# Altium schematic sheet mtk_schematic.SchDoc
size A4
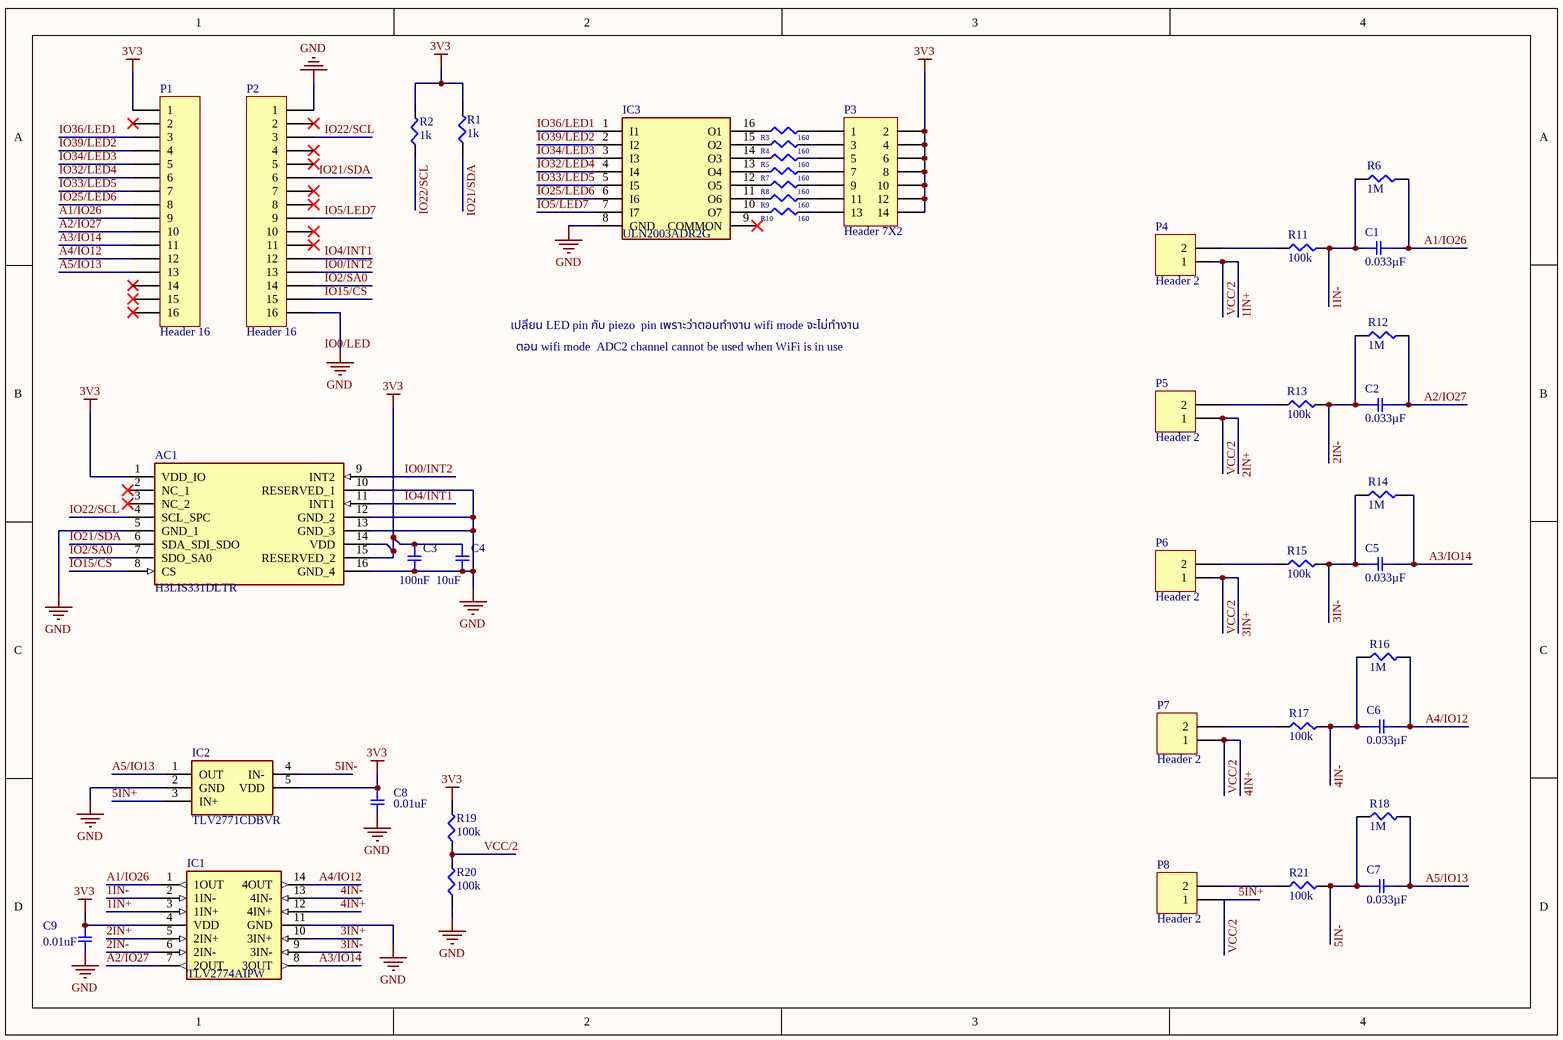
[diagram p0: mtk_schematic.SchDoc]

## Parts
AC1  H3LIS331DLTR  [PQFN50P300X300X100-16N]
C1  0.033µF  [SMD-1206C]
C2  0.033µF  [SMD-1206C]
C3  100nF  [SMD-1206C]
C4  10uF  [SMD-1206C]
C5  0.033µF  [SMD-1206C]
C6  0.033µF  [SMD-1206C]
C7  0.033µF  [SMD-1206C]
C8  0.01uF  [SMD-1206C]
C9  0.01uF  [SMD-1206C]
IC1  TLV2774AIPW  [SOP65P640X120-14N]
IC2  TLV2771CDBVR  [SOT95P280X145-5N]
IC3  ULN2003ADR2G  [SOIC127P600X175-16N]
P1  Header 16  [HDR1X16]
P2  Header 16  [HDR1X16]
P3  Header 7X2  [HDR2X7]
P4  Header 2  [HDR1X2]
P5  Header 2  [HDR1X2]
P6  Header 2  [HDR1X2]
P7  Header 2  [HDR1X2]
P8  Header 2  [HDR1X2]
R1  1k  [SMD-1206-RES]
R2  1k  [SMD-1206-RES]
R3  160  [SMD-1206-RES]
R4  160  [SMD-1206-RES]
R5  160  [SMD-1206-RES]
R6  1M  [SMD-1206-RES]
R7  160  [SMD-1206-RES]
R8  160  [SMD-1206-RES]
R9  160  [SMD-1206-RES]
R10  160  [SMD-1206-RES]
R11  100k  [SMD-1206-RES]
R12  1M  [SMD-1206-RES]
R13  100k  [SMD-1206-RES]
R14  1M  [SMD-1206-RES]
R15  100k  [SMD-1206-RES]
R16  1M  [SMD-1206-RES]
R17  100k  [SMD-1206-RES]
R18  1M  [SMD-1206-RES]
R19  100k  [SMD-1206-RES]
R20  100k  [SMD-1206-RES]
R21  100k  [SMD-1206-RES]

## Nets
3V3: AC1.1(VDD_IO) AC1.14(VDD) AC1.15(RESERVED_2) C3.1 C4.1 C8.1 C9.1 IC1.4(VDD) IC2.5(VDD) P1.1 P3.2 P3.4 P3.6 P3.8 P3.10 P3.12 P3.14 R1.2 R2.2 R19.2
GND: AC1.5(GND_1) AC1.10(RESERVED_1) AC1.12(GND_2) AC1.13(GND_3) AC1.16(GND_4) C3.2 C4.2 C8.2 C9.2 IC1.11(GND) IC2.2(GND) IC3.8(GND) P2.1 P2.16 R20.1
1IN+: IC1.3(1IN+) IC1.5(2IN+) IC1.10(3IN+) IC1.12(4IN+) IC2.3(IN+) P4.1 P5.1 P6.1 P7.1 P8.1 R19.1 R20.2  [also labelled 2IN+, 3IN+, 4IN+, 5IN+, VCC/2]
1IN-: C1.2 IC1.2(1IN-) R6.1 R11.2
2IN-: C2.1 IC1.6(2IN-) R12.1 R13.2
3IN-: C5.1 IC1.9(3IN-) R14.1 R15.2
4IN-: C6.1 IC1.13(4IN-) R16.1 R17.2
5IN-: C7.1 IC2.4(IN-) R18.1 R21.2
A1/IO26: C1.1 IC1.1(1OUT) P1.9 R6.2
A2/IO27: C2.2 IC1.7(2OUT) P1.10 R12.2
A3/IO14: C5.2 IC1.8(3OUT) P1.11 R14.2
A4/IO12: C6.2 IC1.14(4OUT) P1.12 R16.2
A5/IO13: C7.2 IC2.1(OUT) P1.13 R18.2
IO0/INT2: AC1.9(INT2) P2.13
IO2/SA0: AC1.7(SDO_SA0) P2.14
IO4/INT1: AC1.11(INT1) P2.12
IO5/LED7: IC3.7(I7) P2.9
IO15/CS: AC1.8(CS) P2.15
IO21/SDA: AC1.6(SDA_SDI_SDO) P2.6 R1.1
IO22/SCL: AC1.4(SCL_SPC) P2.3 R2.1
IO25/LED6: IC3.6(I6) P1.8
IO32/LED4: IC3.4(I4) P1.6
IO33/LED5: IC3.5(I5) P1.7
IO34/LED3: IC3.3(I3) P1.5
IO36/LED1: IC3.1(I1) P1.3
IO39/LED2: IC3.2(I2) P1.4
NetIC3_10: IC3.10(O7) R10.1
NetIC3_11: IC3.11(O6) R9.1
NetIC3_12: IC3.12(O5) R8.1
NetIC3_13: IC3.13(O4) R7.1
NetIC3_14: IC3.14(O3) R5.1
NetIC3_15: IC3.15(O2) R4.1
NetIC3_16: IC3.16(O1) R3.1
NetP3_1: P3.1 R3.2
NetP3_3: P3.3 R4.2
NetP3_5: P3.5 R5.2
NetP3_7: P3.7 R7.2
NetP3_9: P3.9 R8.2
NetP3_11: P3.11 R9.2
NetP3_13: P3.13 R10.2
NetP4_2: P4.2 R11.1
NetP5_2: P5.2 R13.1
NetP6_2: P6.2 R15.1
NetP7_2: P7.2 R17.1
NetP8_2: P8.2 R21.1

Not connected (* = marked no-connect by the designer): AC1 2(NC_1)* 3(NC_2)*; IC3 9(COMMON)*; P1 2* 14* 15* 16*; P2 2* 4* 5* 7* 8* 10* 11*

## Notes on the sheet
- เปลี่ยน LED pin กับ piezo  pin เพราะว่าตอนทำงาน wifi mode จะไม่ทำงาน
- ตอน wifi mode  ADC2 channel cannot be used when WiFi is in use
- Labels drawn without touching a wire or pin: IO0/LED

## Library data of the parts
AC1 = H3LIS331DLTR: Accelerometer; Manufacturer_Name: STMicroelectronics; Datasheet Link: http://www.st.com/st-web-ui/static/active/en/resource/technical/document/datasheet/DM00053090.pdf; Height: 1mm; Manufacturer_Part_Number: H3LIS331DLTR; Mouser Part Number: 511-H3LIS331DLTR; Mouser Price/Stock: https://www.mouser.com/Search/Refine.aspx?Keyword=511-H3LIS331DLTR; RS Part Number: 1106549P; RS Price/Stock: http://uk.rs-online.com/web/p/products/1106549P
C1 C2 C5-C7 = GC331AD72E333KX01D: CAP CER 0.033UF 250V X7T 1206; Manufacturer: Murata Electronics North America; Factory Stock: 0; Unit Price (USD): 0.33; Minimum Quantity: 1; Tolerance: ±10%; Datasheets: http://search.murata.co.jp/Ceramy/image/img/A01X/G101/ENG/GC331AD72E333KX01-01.pdf; Image: //media.digikey.com/Renders/Murata%20Renders/1206(GC3)320x160.jpg; Digi-Key Part Number: 490-13989-1-ND; Part Number: GC331AD72E333KX01D; Quantity Available: 3999; @ qty: 0; Packaging: Cut Tape (CT); Series: GC3; Part Status: Active; Value: 0.033µF; Voltage: 250V; Temperature Coefficient: X7T; Operating Temperature: -55°C ~ 125°C; Features: -; Ratings: AEC-Q200; Applications: Automotive; Mounting Type: Surface Mount, MLCC; Package / Case: 1206 (3216 Metric); Size / Dimension: 0.126" L x 0.063" W (3.20mm x 1.60mm); Height - Seated (Max): -; Thickness (Max): 0.039" (1.00mm); Lead Spacing: -; Lead Style: -
C3 C4 C8 C9 = LLM315R71C104MA11L: CAP CER 0.1UF 16V X7R 1206; Manufacturer: Murata Electronics North America; Factory Stock: 0; Unit Price (USD): 0.9; Minimum Quantity: 1; Value: 0.10µF; Tolerance: ±20%; Datasheets: http://www.murata.com/~/media/webrenewal/support/library/catalog/products/capacitor/mlcc/c02e.pdf; Image: //media.digikey.com/Renders/Murata%20Renders/1206(LLM315).jpg; Digi-Key Part Number: 490-4495-1-ND; Part Number: LLM315R71C104MA11L; Quantity Available: 2915; @ qty: 0; Packaging: Cut Tape (CT); Series: LLM; Part Status: Active; Voltage: 16V; Temperature Coefficient: X7R; Operating Temperature: -55°C ~ 125°C; Features: Low ESL (Multi-Terminal); Ratings: -; Applications: Bypass, Decoupling; Mounting Type: Surface Mount, MLCC; Package / Case: 1206 (3216 Metric); Size / Dimension: 0.126" L x 0.063" W (3.20mm x 1.60mm); Height - Seated (Max): -; Thickness (Max): 0.022" (0.55mm); Lead Spacing: -; Lead Style: -
IC1 = TLV2774AIPW: Integrated Circuit; Manufacturer_Name: Texas Instruments; Datasheet Link: http://www.ti.com/lit/ds/symlink/tlv2774a.pdf; Height: 1.2mm; Manufacturer_Part_Number: TLV2774AIPW; RS Part Number: 4625114; RS Price/Stock: https://uk.rs-online.com/web/p/products/4625114
IC2 = TLV2771CDBVR: Integrated Circuit; Manufacturer_Name: Texas Instruments; Datasheet Link: http://www.ti.com/lit/gpn/tlv2771; Manufacturer_Part_Number: TLV2771CDBVR; Mouser Part Number: 595-TLV2771CDBVR; Mouser Price/Stock: https://www.mouser.com/Search/Refine.aspx?Keyword=595-TLV2771CDBVR
IC3 = ULN2003ADR2G: Integrated Circuit; Manufacturer_Name: ON Semiconductor; Datasheet Link: http://www.onsemi.com/pub/Collateral/ULN2003A-D.PDF; Height: 1.75mm; Manufacturer_Part_Number: ULN2003ADR2G; Mouser Part Number: 863-ULN2003ADR2G; Mouser Price/Stock: https://www.mouser.com/Search/Refine.aspx?Keyword=863-ULN2003ADR2G; RS Part Number: 1868994; RS Price/Stock: http://uk.rs-online.com/web/p/products/1868994
P1 P2 = Header 16: Header, 16-Pin; LatestRevisionDate: 17-Jul-2002; LatestRevisionNote: Re-released for DXP Platform.; Publisher: Altium Limited
P3 = Header 7X2: Header, 7-Pin, Dual row; LatestRevisionDate: 17-Jul-2002; LatestRevisionNote: Re-released for DXP Platform.; Publisher: Altium Limited
P4-P8 = Header 2: Header, 2-Pin; LatestRevisionDate: 17-Jul-2002; LatestRevisionNote: Re-released for DXP Platform.; Publisher: Altium Limited
R1 R2 = ERJ-8ENF1001V: RES SMD 1K OHM 1% 1/4W 1206; Manufacturer: Panasonic Electronic Components; Factory Stock: 0; Unit Price (USD): 0.00933; @ qty: 1500; Minimum Quantity: 1; Power (Watts): 0.25W, 1/4W; Temperature Coefficient: ±100ppm/°C; Part Number: ERJ-8ENF1001V; Datasheets: http://industrial.panasonic.com/www-cgi/jvcr13pz.cgi?E+PZ+3+AOA0002+ERJ8ENF1001V+7+WW; Image: //media.digikey.com/Renders/Panasonic%20Renders/ERJ-1206%20Pkg.jpg; Digi-Key Part Number: P1.00KFCT-ND; Quantity Available: 607104; Packaging: Cut Tape (CT); Series: ERJ; Part Status: Active; Value: 1k; Tolerance: ±1%; Composition: Thick Film; Features: Automotive AEC-Q200; Operating Temperature: -55°C ~ 155°C; Package / Case: 1206 (3216 Metric); Supplier Device Package: 1206; Size / Dimension: 0.126" L x 0.063" W (3.20mm x 1.60mm); Height - Seated (Max): 0.028" (0.70mm); Number of Terminations: 2; Failure Rate: -
R3-R5 R7-R10 = ERJ-8ENF1600V: RES SMD 160 OHM 1% 1/4W 1206; Manufacturer: Panasonic Electronic Components; Factory Stock: 0; Unit Price (USD): 0.00933; @ qty: 1500; Minimum Quantity: 1; Power (Watts): 0.25W, 1/4W; Temperature Coefficient: ±100ppm/°C; Part Number: ERJ-8ENF1600V; Datasheets: http://industrial.panasonic.com/www-cgi/jvcr13pz.cgi?E+PZ+3+AOA0002+ERJ8ENF1600V+7+WW; Image: //media.digikey.com/Renders/Panasonic%20Renders/ERJ-1206%20Pkg.jpg; Digi-Key Part Number: P160FCT-ND; Quantity Available: 54151; Packaging: Cut Tape (CT); Series: ERJ; Part Status: Active; Value: 160; Tolerance: ±1%; Composition: Thick Film; Features: Automotive AEC-Q200; Operating Temperature: -55°C ~ 155°C; Package / Case: 1206 (3216 Metric); Supplier Device Package: 1206; Size / Dimension: 0.126" L x 0.063" W (3.20mm x 1.60mm); Height - Seated (Max): 0.028" (0.70mm); Number of Terminations: 2; Failure Rate: -
R6 R12 R14 R16 R18 = ERJ-8ENF1004V: RES SMD 1M OHM 1% 1/4W 1206; Manufacturer: Panasonic Electronic Components; Factory Stock: 0; Unit Price (USD): 0.00933; @ qty: 1500; Minimum Quantity: 1; Power (Watts): 0.25W, 1/4W; Temperature Coefficient: ±100ppm/°C; Part Number: ERJ-8ENF1004V; Datasheets: http://industrial.panasonic.com/www-cgi/jvcr13pz.cgi?E+PZ+3+AOA0002+ERJ8ENF1004V+7+WW; Image: //media.digikey.com/Renders/Panasonic%20Renders/ERJ-1206%20Pkg.jpg; Digi-Key Part Number: P1.00MFCT-ND; Quantity Available: 390460; Packaging: Cut Tape (CT); Series: ERJ; Part Status: Active; Value: 1M; Tolerance: ±1%; Composition: Thick Film; Features: Automotive AEC-Q200; Operating Temperature: -55°C ~ 155°C; Package / Case: 1206 (3216 Metric); Supplier Device Package: 1206; Size / Dimension: 0.126" L x 0.063" W (3.20mm x 1.60mm); Height - Seated (Max): 0.028" (0.70mm); Number of Terminations: 2; Failure Rate: -
R11 R13 R15 R17 R19-R21 = ERJ-8ENF1003V: RES SMD 100K OHM 1% 1/4W 1206; Manufacturer: Panasonic Electronic Components; Factory Stock: 0; Unit Price (USD): 0.00933; @ qty: 1500; Minimum Quantity: 1; Power (Watts): 0.25W, 1/4W; Temperature Coefficient: ±100ppm/°C; Part Number: ERJ-8ENF1003V; Datasheets: http://industrial.panasonic.com/www-cgi/jvcr13pz.cgi?E+PZ+3+AOA0002+ERJ8ENF1003V+7+WW; Image: //media.digikey.com/Renders/Panasonic%20Renders/ERJ-1206%20Pkg.jpg; Digi-Key Part Number: P100KFCT-ND; Quantity Available: 576605; Packaging: Cut Tape (CT); Series: ERJ; Part Status: Active; Value: 100k; Tolerance: ±1%; Composition: Thick Film; Features: Automotive AEC-Q200; Operating Temperature: -55°C ~ 155°C; Package / Case: 1206 (3216 Metric); Supplier Device Package: 1206; Size / Dimension: 0.126" L x 0.063" W (3.20mm x 1.60mm); Height - Seated (Max): 0.028" (0.70mm); Number of Terminations: 2; Failure Rate: -